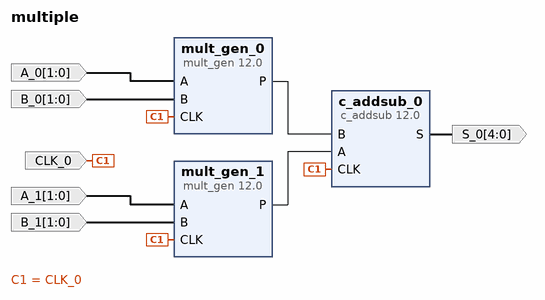
[diagram p0: block diagram of the top level]
# Vivado block design multiple, xc7z020clg484-1, Vivado 2018.2
create_bd_design multiple

create_bd_port -dir I -from 1 -to 0 -type data A_0
create_bd_port -dir I -from 1 -to 0 -type data B_0
create_bd_port -dir I -from 1 -to 0 -type data A_1
create_bd_port -dir I -from 1 -to 0 -type data B_1
create_bd_port -dir I -type clk CLK_0
create_bd_port -dir O -from 4 -to 0 -type data S_0

create_bd_cell -type ip -vlnv xilinx.com:ip:mult_gen:12.0 mult_gen_1
set_property -dict [list \
  CONFIG.PortAType Unsigned \
  CONFIG.PortAWidth 2 \
  CONFIG.PortBType Unsigned \
  CONFIG.PortBWidth 2 \
] [get_bd_cells mult_gen_1]
create_bd_cell -type ip -vlnv xilinx.com:ip:mult_gen:12.0 mult_gen_0
set_property -dict [list \
  CONFIG.PortAType Unsigned \
  CONFIG.PortAWidth 2 \
  CONFIG.PortBType Unsigned \
  CONFIG.PortBWidth 2 \
] [get_bd_cells mult_gen_0]
create_bd_cell -type ip -vlnv xilinx.com:ip:c_addsub:12.0 c_addsub_0
set_property -dict [list \
  CONFIG.A_Type Unsigned \
  CONFIG.B_Type Unsigned \
  CONFIG.A_Width 4 \
  CONFIG.B_Width 4 \
  CONFIG.Out_Width 5 \
  CONFIG.Latency 1 \
  CONFIG.B_Value 0000 \
  CONFIG.CE false \
] [get_bd_cells c_addsub_0]

# ---- connections ----

connect_bd_net -net A_0_1 [get_bd_ports A_0] [get_bd_pins mult_gen_0/A]
connect_bd_net -net B_0_1 [get_bd_ports B_0] [get_bd_pins mult_gen_0/B]
connect_bd_net [get_bd_pins mult_gen_0/P] [get_bd_pins c_addsub_0/B]
connect_bd_net -net A_1_1 [get_bd_ports A_1] [get_bd_pins mult_gen_1/A]
connect_bd_net -net B_1_1 [get_bd_ports B_1] [get_bd_pins mult_gen_1/B]
connect_bd_net [get_bd_pins mult_gen_1/P] [get_bd_pins c_addsub_0/A]
connect_bd_net -net CLK_0_1 [get_bd_ports CLK_0] [get_bd_pins c_addsub_0/CLK] [get_bd_pins mult_gen_1/CLK] [get_bd_pins mult_gen_0/CLK]
connect_bd_net [get_bd_pins c_addsub_0/S] [get_bd_ports S_0]

validate_bd_design
save_bd_design
